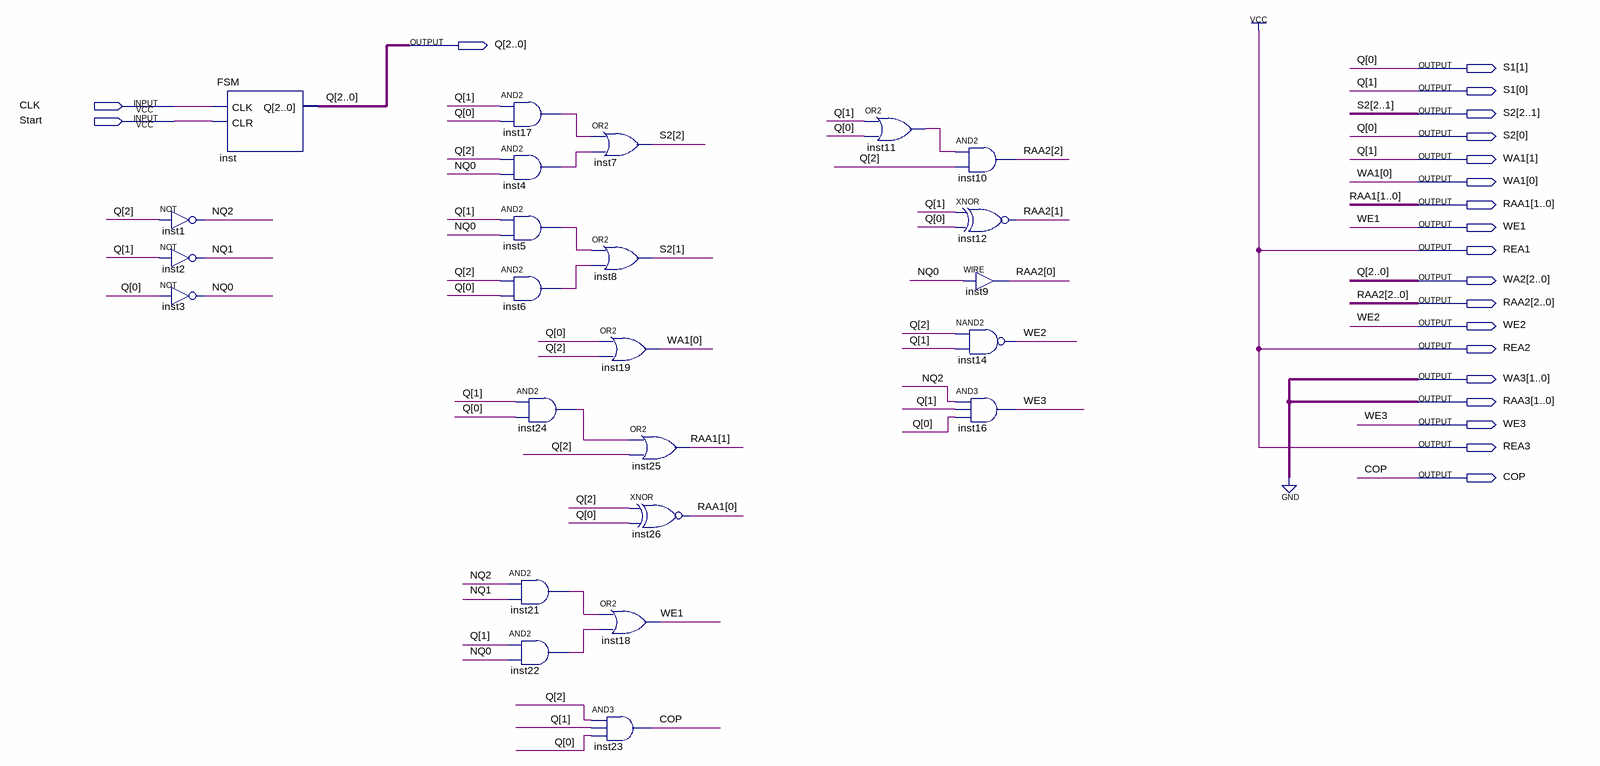
[diagram p0: schematic sheet]
// Quartus schematic Control.bdf as structural Verilog: 24 symbols, 21 pins
module Control (
  input  CLK,
  input  Start,
  output [2:0] Q,
  output [1:0] S1,
  output [2:0] S2,
  output [1:0] WA1,
  output [1:0] RAA1,
  output WE1,
  output REA1,
  output [2:0] WA2,
  output [2:0] RAA2,
  output WE2,
  output REA2,
  output [1:0] WA3,
  output [1:0] RAA3,
  output WE3,
  output REA3,
  output COP
);

  wire inst4_out, inst5_out, inst6_out, inst11_out, inst17_out, inst21_out, inst22_out, inst24_out, NQ0, NQ1,
       NQ2;

  not inst1 (NQ2, Q[2]);
  not inst2 (NQ1, Q[1]);
  not inst3 (NQ0, Q[0]);
  FSM inst (.CLK(CLK), .CLR(Start), .Q(Q));
  and inst17 (inst17_out, Q[1], Q[0]);
  and inst4 (inst4_out, Q[2], NQ0);
  and inst5 (inst5_out, Q[1], NQ0);
  and inst6 (inst6_out, Q[2], Q[0]);
  and inst24 (inst24_out, Q[1], Q[0]);
  and inst21 (inst21_out, NQ2, NQ1);
  and inst22 (inst22_out, Q[1], NQ0);
  or inst7 (S2[2], inst17_out, inst4_out);
  or inst8 (S2[1], inst5_out, inst6_out);
  or inst19 (WA1[0], Q[0], Q[2]);
  or inst18 (WE1, inst21_out, inst22_out);
  and inst23 (COP, Q[2], Q[1], Q[0]);
  or inst25 (RAA1[1], inst24_out, Q[2]);
  xnor inst26 (RAA1[0], Q[2], Q[0]);
  or inst11 (inst11_out, Q[1], Q[0]);
  and inst10 (RAA2[2], inst11_out, Q[2]);
  xnor inst12 (RAA2[1], Q[1], Q[0]);
  assign RAA2[0] = NQ0;  // WIRE inst9
  nand inst14 (WE2, Q[2], Q[1]);
  and inst16 (WE3, NQ2, Q[1], Q[0]);

  assign RAA3 = 2'b00;
  assign REA1 = 1'b1;
  assign REA2 = 1'b1;
  assign REA3 = 1'b1;
  assign S1 = {Q[0], Q[1]};
  assign S2[0] = Q[0];
  assign WA1[1] = Q[1];
  assign WA2 = Q;
  assign WA3 = 2'b00;
endmodule
